# EAGLE design cirquit (EAGLE 8.3.2)
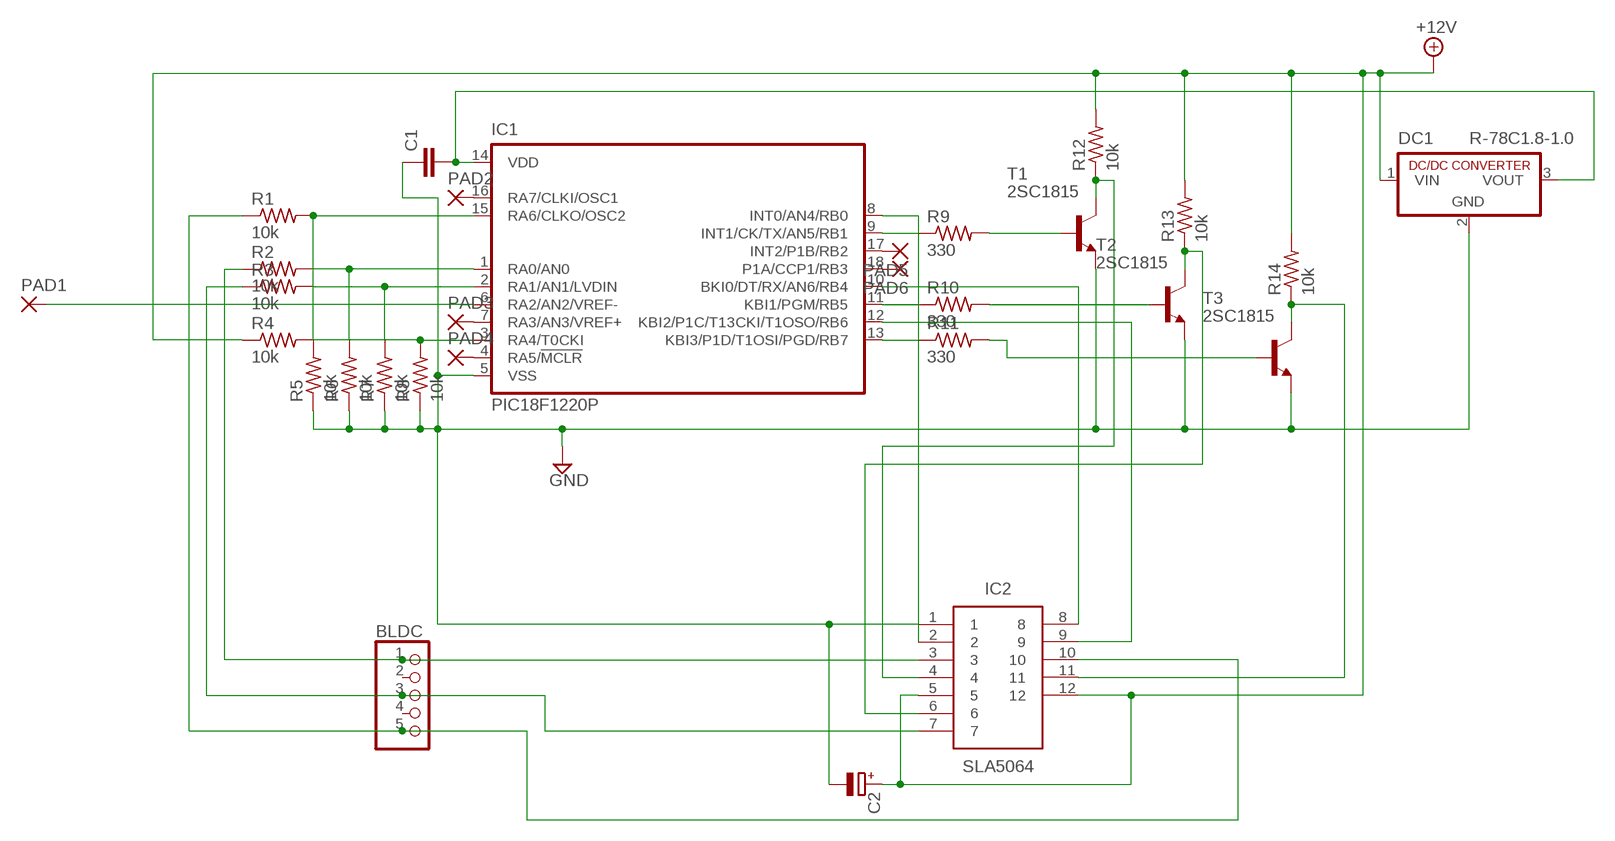
[diagram p0: schematic, sheet 1]

## Parts
BLDC  PINHD-1X5  [1X05]
C1  C2.5/2  [C2.5-2]
C2  CPOL-EUE2,5-6E  [E2,5-6E]
DC1  R-78C1.8-1.0  [SIP3]
IC1  PIC18F1220P  [DIL18]
IC2  SLA5064  [TO254P500X3150X1890-12P]
PAD1  1,6/0,8  [1,6/0,8]
PAD2  1,6/0,8  [1,6/0,8]
PAD3  1,6/0,8  [1,6/0,8]
PAD4  1,6/0,8  [1,6/0,8]
PAD5  1,6/0,8  [1,6/0,8]
PAD6  1,6/0,8  [1,6/0,8]
R1  10k  R-US_0204/7  [0204/7]
R2  10k  R-US_0204/7  [0204/7]
R3  10k  R-US_0204/7  [0204/7]
R4  10k  R-US_0204/7  [0204/7]
R5  10k  R-US_0204/7  [0204/7]
R6  10k  R-US_0204/7  [0204/7]
R7  10k  R-US_0204/7  [0204/7]
R8  10k  R-US_0204/7  [0204/7]
R9  330  R-US_0204/7  [0204/7]
R10  330  R-US_0204/7  [0204/7]
R11  330  R-US_0204/7  [0204/7]
R12  10k  R-US_0204/7  [0204/7]
R13  10k  R-US_0204/7  [0204/7]
R14  10k  R-US_0204/7  [0204/7]
T1  2SC1815  [TO92-ECB]
T2  2SC1815  [TO92-ECB]
T3  2SC1815  [TO92-ECB]

## Nets
+12V: C2.+ DC1.1(VIN) IC2.5 IC2.12 R4.1 R12.2 R13.2 R14.2
GND: C1.1 C2.- DC1.2(GND) IC1.5(VSS) IC2.1 R5.1 R6.1 R7.1 R8.1 T1.E T2.E T3.E
N$1: IC1.15(RA6/CLKO/OSC2) R1.2 R5.2
N$2: IC1.1(RA0/AN0) R2.2 R6.2
N$3: IC1.2(RA1/AN1/LVDIN) R3.2 R7.2
N$4: IC1.3(RA4/T0CKI) R4.2 R8.2
N$5: IC1.16(RA7/CLKI/OSC1) PAD2.1(P)
N$6: BLDC.1 IC2.3 R2.1
N$7: BLDC.3 IC2.7 R3.1
N$9: IC1.9(INT1/CK/TX/AN5/RB1) R9.1
N$10: IC1.11(KBI1/PGM/RB5) R10.1
N$11: IC1.13(KBI3/P1D/T1OSI/PGD/RB7) R11.1
N$12: R9.2 T1.B
N$13: R10.2 T2.B
N$14: R11.2 T3.B
N$15: IC2.4 R12.1 T1.C
N$16: IC2.6 R13.1 T2.C
N$17: IC2.11 R14.1 T3.C
N$18: IC1.7(RA3/AN3/VREF+) PAD3.1(P)
N$19: IC1.4(RA5/!MCLR) PAD4.1(P)
N$20: IC1.17(INT2/P1B/RB2) PAD5.1(P)
N$21: IC1.18(P1A/CCP1/RB3) PAD6.1(P)
N$22: IC1.8(INT0/AN4/RB0) IC2.2
N$23: IC1.10(BKI0/DT/RX/AN6/RB4) IC2.8
N$24: IC1.12(KBI2/P1C/T13CKI/T1OSO/RB6) IC2.9
N$25: IC1.6(RA2/AN2/VREF-) PAD1.1(P)
N$26: C1.2 DC1.3(VOUT) IC1.14(VDD)
N$28: BLDC.5 IC2.10 R1.1
Unconnected: BLDC.2 BLDC.4

## Library data of the parts
BLDC = pinhead:PINHD-1X5: PIN HEADER
C1 = capacitor-wima:C: CAPACITOR naming: grid - package width
C2 = resistor:CPOL-EU: POLARIZED CAPACITOR, European symbol
DC1 = dc-dc-converter:R-78C*-1.0: INNOLINE DC/DC-Converter 1.0 AMP SIP3 Single Output Source: Data sheet <http://www.mikrocontroller.net/attachment/150645/157764-da-01-en-DC_DC_WANDLER_R_78C5_0_1_0.pdf>
IC1 = microchip:PIC18F1*20: 18/20/28-Pin High-Performance, Enhanced Flash Microcontrollers with 10-bit A/D and nanoWatt Technology Source: ww1.microchip.com/downloads/en/DeviceDoc/39605c.pdf; MF: MICROCHIP; MPN: PIC18F1220-I/P; OC_FARNELL: 9761977; OC_NEWARK: 92C2429
IC2 = SLA5064:SLA5064: N-channel+P-channel 3-phase motor drive <https://componentsearchengine.com/Images/9/SLA5064.jpg> Source: Datasheet <http://akizukidenshi.com/download/ds/sanken/sla5064_ds_jp.pdf>; DESCRIPTION: N-channel+P-channel 3-phase motor drive; HEIGHT: 5mm; MANUFACTURER_NAME: Sanken; MANUFACTURER_PART_NUMBER: SLA5064; SUPPLIER_NAME: RS
PAD1-PAD6 = wirepad:1,6/0,8: THROUGH-HOLE PAD
R1-R14 = resistor:R-US_: RESISTOR, American symbol
T1-T3 = transistor:2SC1815: NPN EPITAXIAL TRANSISTOR Source: TOSHIBA .. 2SC1815 1.pdf

## Board
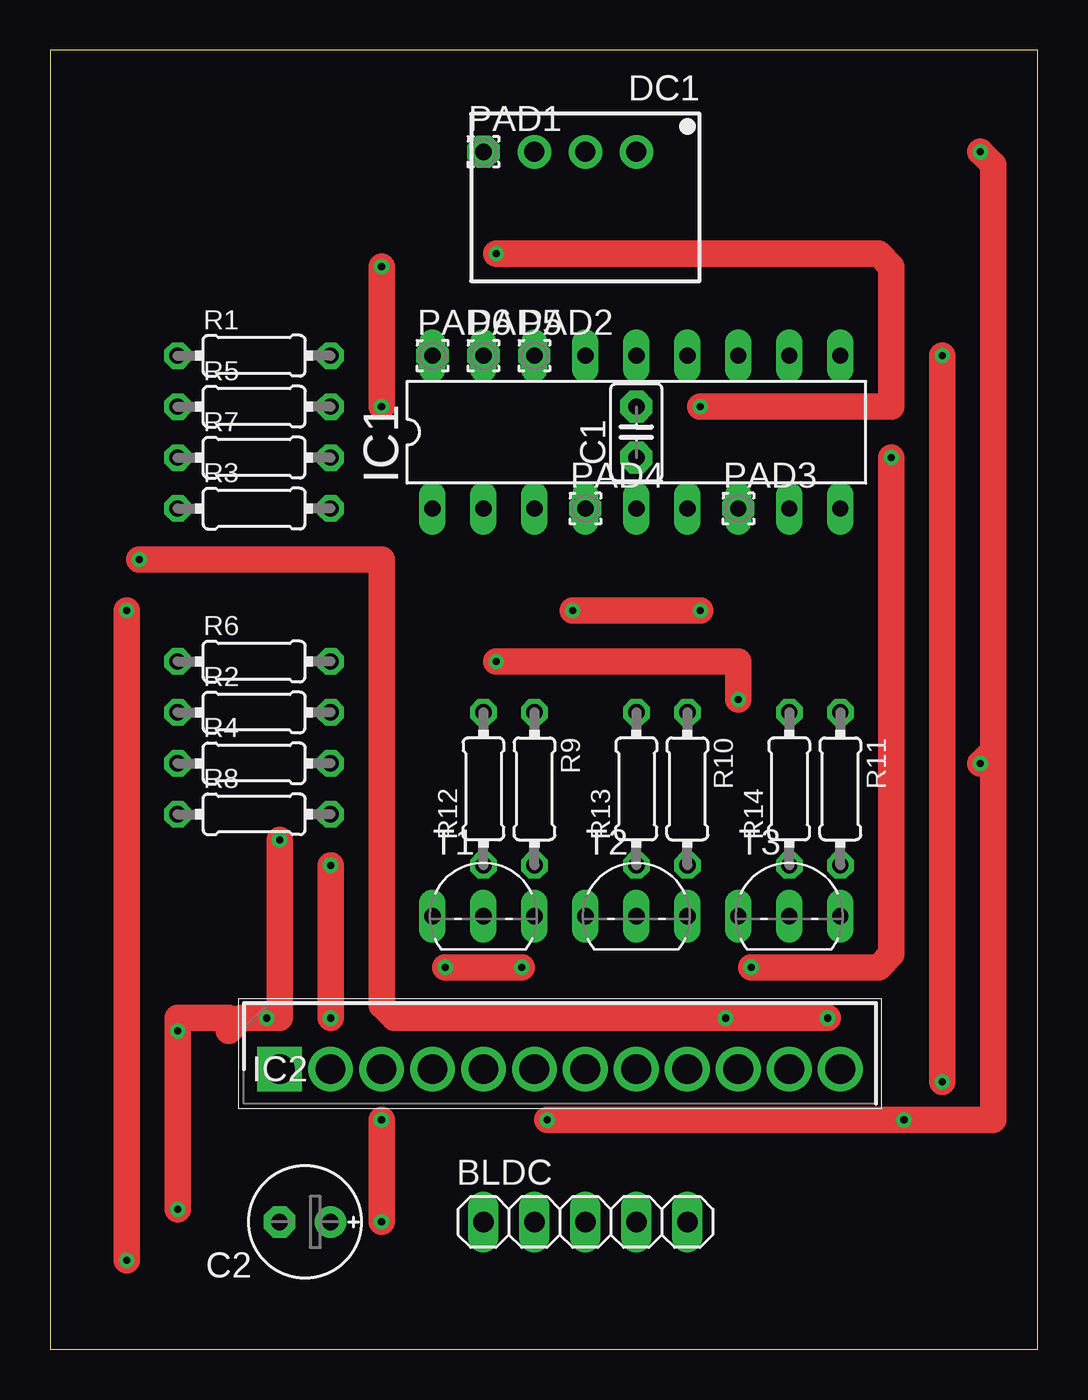
[diagram p1: board, top side]
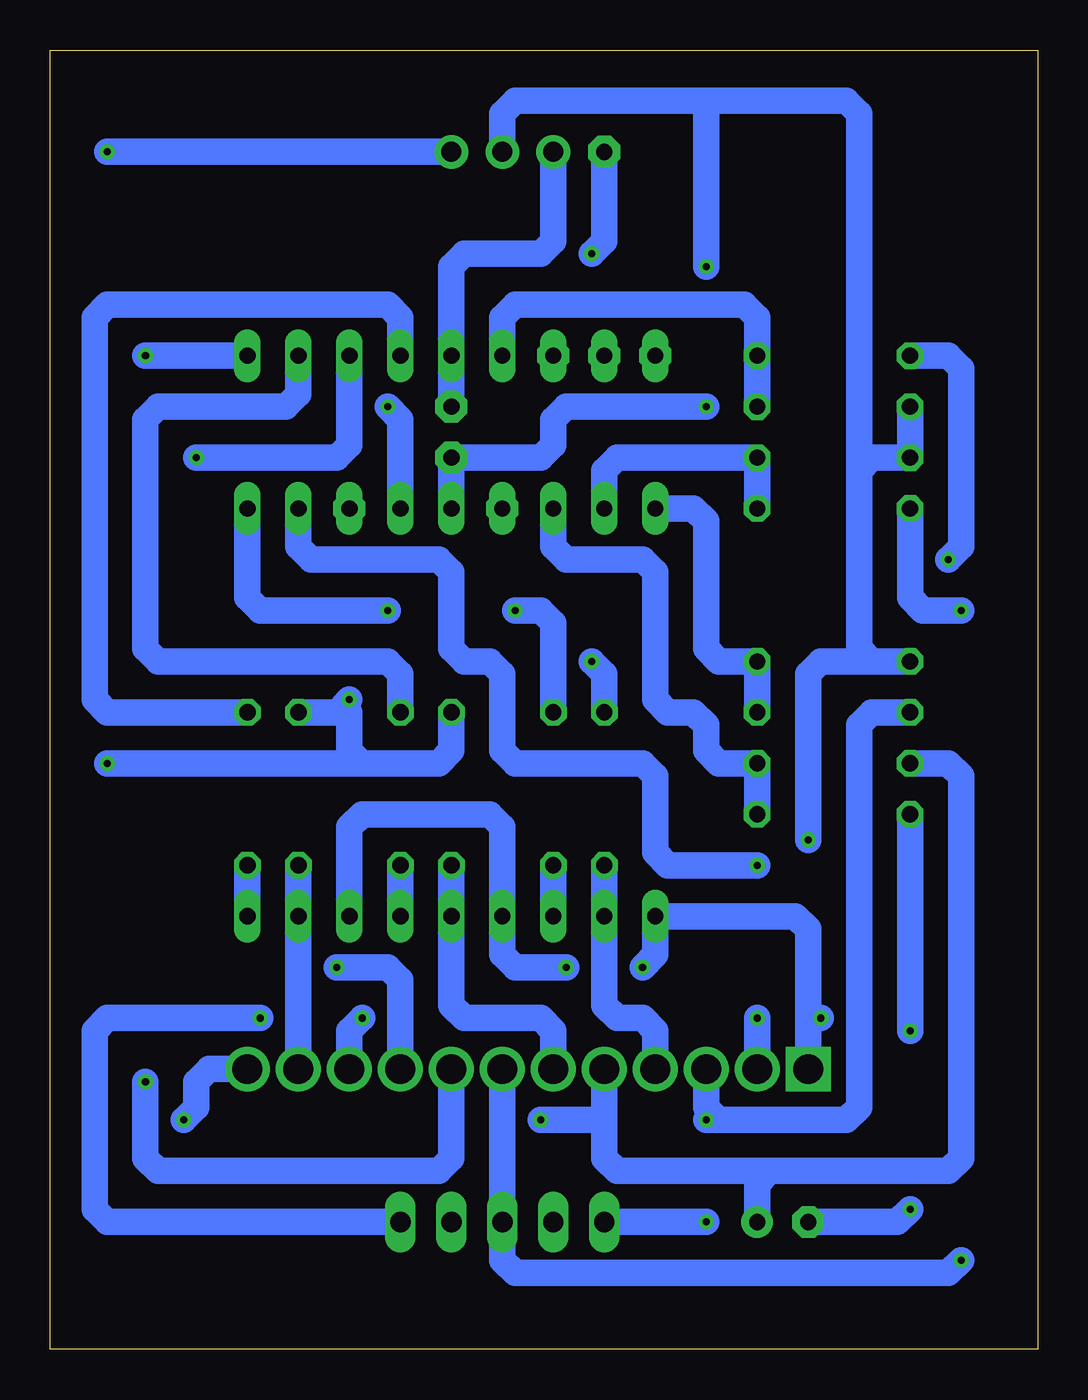
[diagram p2: board, bottom side, seen from below]

Size 49.2 x 64.76 mm. Coordinates in mm from the lower left corner, seen from the top.
Outline: 0,0 49.2,0 49.2,64.76 0,64.76 0,0
Copper layers (1*16): Top 0.035mm / dielectric 1.5mm / Bottom 0.035mm
Design rules "default *": minimum track width 51.5mil, minimum drill 0.35mm, track to track 6mil, track to pad 6mil, pad to pad 6mil, via to via 6mil, smd to smd 6mil, copper to edge 40mil, drill to drill 6mil, minimum pad ring 10mil, minimum via ring 8mil, stop-mask expansion 4mil, vias tented up to drill 0mil, thermal gap 10mil
tRestrict: area 13.7,44.1 to 14.3,44.8; area 8.6,49.2 to 9.2,49.8; area 6,28.9 to 6.7,29.5; area 11.1,26.4 to 11.7,27; area 11.1,34 to 11.7,34.6; area 17.5,30.2 to 18.1,30.8; area 17.5,27.6 to 18.1,28.3; area 17.5,25.1 to 18.1,25.7; area 20,30.2 to 20.6,30.8; area 22.5,30.2 to 23.2,30.8; area 20,27.6 to 20.6,28.3; area 22.5,27.6 to 23.2,28.3; 557 more areas
bRestrict: area 17.5,30.2 to 18.1,30.8; area 20,30.2 to 20.6,30.8; area 20,27.6 to 20.6,28.3; area 17.5,27.6 to 18.1,28.3; area 17.5,25.1 to 18.1,25.7; area 20,25.1 to 20.6,25.7; area 22.5,30.2 to 23.2,30.8; area 22.5,27.6 to 23.2,28.3; area 22.5,25.1 to 23.2,25.7; area 25.1,30.2 to 25.7,30.8; area 27.6,30.2 to 28.3,30.8; area 27.6,27.6 to 28.3,28.3; 438 more areas

### Footprints (pad centres in the part's own frame; a part is rotated, then mirrored left to right if it is on the bottom)
1X05 = drill 1.016 long: 1 -5.08,0; 2 -2.54,0; 3 0,0; 4 2.54,0; 5 5.08,0
C2.5-2 = drill 0.813 pad 1.6 octagon: 1 -1.27,0; 2 1.27,0
E2,5-6E = drill 0.813 pad 1.575: + -1.27,0 | drill 0.813 pad 1.575 octagon: - 1.27,0
SIP3 = drill 1 pad 1.676: 1 -2.54,0; 2 0,0; 3 2.54,0
DIL18 = drill 0.813 long: 1 -10.16,-3.81; 2 -7.62,-3.81; 3 -5.08,-3.81; 4 -2.54,-3.81; 5 0,-3.81; 6 2.54,-3.81; 7 5.08,-3.81; 8 7.62,-3.81; 9 10.16,-3.81; 10 10.16,3.81; 11 7.62,3.81; 12 5.08,3.81; 13 2.54,3.81; 14 0,3.81; 15 -2.54,3.81; 16 -5.08,3.81; 17 -7.62,3.81; 18 -10.16,3.81
TO254P500X3150X1890-12P = drill 1.49 pad 2.235 square: 1 0,0 | drill 1.49 pad 2.235: 2 2.54,0; 3 5.08,0; 4 7.62,0; 5 10.16,0; 6 12.7,0; 7 15.24,0; 8 17.78,0; 9 20.32,0; 10 22.86,0; 11 25.4,0; 12 27.94,0
1,6/0,8 = drill 0.813 pad 1.6 octagon: 1 0,0
0204/7 = drill 0.813 octagon: 1 -3.81,0; 2 3.81,0
TO92-ECB = drill 0.813 long: B 2.54,0; C 0,0; E -2.54,0

### Placement (x,y rotation side)
BLDC  26.67,6.35 0 top
C1  29.21,45.72 90 top
C2  12.7,6.35 180 top
DC1  26.67,59.69 180 top
IC1  29.21,45.72 0 top
IC2  11.43,13.97 0 top
PAD1  21.59,59.69 0 top
PAD2  24.13,49.53 0 top
PAD3  34.29,41.91 0 top
PAD4  26.67,41.91 0 top
PAD5  21.59,49.53 0 top
PAD6  19.05,49.53 0 top
R1  10.16,49.53 0 top
R2  10.16,31.75 0 top
R3  10.16,41.91 0 top
R4  10.16,29.21 0 top
R5  10.16,46.99 0 top
R6  10.16,34.29 0 top
R7  10.16,44.45 0 top
R8  10.16,26.67 0 top
R9  24.13,27.94 270 top
R10  31.75,27.94 270 top
R11  39.37,27.94 270 top
R12  21.59,27.94 90 top
R13  29.21,27.94 90 top
R14  36.83,27.94 90 top
T1  21.59,21.59 0 top
T2  29.21,21.59 0 top
T3  36.83,21.59 0 top

### Tracks (layer width: path | path; a pad name or v marks a point on that pad's centre or on a via)
+12V  (via drill 0.35)
  Top 1.308: v22.23,34.29 34.29,34.29 v34.29,32.38 | v46.35,59.69 46.99,59.05 46.99,29.84 | v46.35,29.21 46.99,29.84 | 46.99,29.84 46.99,11.43 v42.54,11.43 v24.77,11.43
  Bottom 1.308: R4.1 4.45,29.21 3.81,28.57 3.81,9.53 4.45,8.89 13.34,8.89 | 13.34,8.89 13.97,8.26 C2.+ | 21.59,11.43 21.59,9.53 20.96,8.89 13.34,8.89 | 21.59,11.43 IC2.5 | R12.2 21.59,33.65 v22.23,34.29 | 34.61,32.07 34.92,31.75 R14.2 | 34.61,32.07 v34.29,32.38 | R13.2 29.21,29.84 29.84,29.21 33.65,29.21 | 33.65,29.21 34.29,29.84 34.29,31.75 34.61,32.07 | v46.35,59.69 DC1.1 | 33.65,29.21 v46.35,29.21 | IC2.12 41.27,13.97 41.91,13.34 41.91,12.07 v42.54,11.43 | v24.77,11.43 21.59,11.43
GND  (via drill 0.35)
  Top 1.308: v6.35,6.99 v6.35,15.88 6.35,16.51 8.89,16.51 8.89,15.88 9.53,16.51 v10.79,16.51 11.43,16.51 v11.43,25.4 | v19.68,19.05 v23.5,19.05 | v16.51,53.97 v16.51,46.99
  Bottom 1.308: v6.35,15.88 R8.1 | v6.35,6.99 6.99,6.35 C2.- | T3.E 34.29,26.04 33.65,26.67 27.3,26.67 26.67,26.04 T2.E 26.67,19.68 26.04,19.05 v23.5,19.05 | IC2.1 11.43,16.51 | 11.43,16.51 11.43,20.96 12.07,21.59 T1.E 19.05,19.68 v19.68,19.05 | v10.79,16.51 11.43,16.51 | IC1.5 C1.1 24.77,44.45 24.13,45.08 24.13,46.35 23.5,46.99 v16.51,46.99 | 8.26,34.29 R6.1 | 8.26,34.29 8.89,34.92 8.89,43.81 | 8.89,43.81 8.26,44.45 R7.1 R5.1 | DC1.2 26.67,61.59 26.04,62.23 16.51,62.23 | 16.51,62.23 9.53,62.23 8.89,61.59 8.89,43.81 | v16.51,53.97 16.51,62.23 | v11.43,25.4 11.43,33.65 10.79,34.29 8.26,34.29
N$1
  Bottom 1.308: R5.2 R1.2 13.97,51.43 14.61,52.07 26.04,52.07 26.67,51.43 IC1.15
N$2
  Bottom 1.308: R2.2 R6.2 15.88,34.29 16.51,34.92 16.51,41.27 17.14,41.91 IC1.1
N$3
  Bottom 1.308: R3.2 R7.2 20.96,44.45 21.59,43.81 IC1.2
N$4
  Bottom 1.308: R8.2 R4.2 15.88,29.21 16.51,29.84 16.51,31.11 17.14,31.75 18.41,31.75 19.05,32.38 19.05,38.73 19.68,39.37 23.5,39.37 24.13,40 IC1.3
N$6  (via drill 0.35)
  Top 1.308: v16.51,11.43 v16.51,6.35
  Bottom 1.308: R2.1 8.26,31.75 8.89,31.11 8.89,12.07 9.53,11.43 15.88,11.43 | 15.88,11.43 16.51,12.07 IC2.3 | v16.51,6.35 BLDC.1 | v16.51,11.43 15.88,11.43
N$7  (via drill 0.35)
  Top 1.308: v3.81,4.45 v3.81,36.83
  Bottom 1.308: R3.1 6.35,37.46 5.71,36.83 v3.81,36.83 | v3.81,4.45 4.45,3.81 26.04,3.81 26.67,4.45 BLDC.3 IC2.7
N$9  (via drill 0.35)
  Top 1.308: v32.38,36.83 v26.04,36.83
  Bottom 1.308: R9.1 24.13,36.2 24.77,36.83 v26.04,36.83 | v32.38,36.83 38.73,36.83 39.37,37.46 IC1.9
N$10
  Bottom 1.308: R10.1 31.75,33.65 32.38,34.29 43.81,34.29 44.45,34.92 44.45,46.35 43.81,46.99 37.46,46.99 36.83,47.62 IC1.11
N$11
  Bottom 1.308: R11.1 46.35,31.75 46.99,32.38 46.99,51.43 46.35,52.07 32.38,52.07 31.75,51.43 IC1.13
N$12
  Bottom 1.308: R9.2 T1.B
N$13
  Bottom 1.308: R10.2 T2.B
N$14
  Bottom 1.308: R11.2 T3.B
N$15
  Bottom 1.308: R12.1 T1.C 21.59,17.14 20.96,16.51 19.68,16.51 19.05,15.88 IC2.4
N$16
  Bottom 1.308: R13.1 T2.C 29.21,17.14 28.57,16.51 24.77,16.51 24.13,15.88 IC2.6
N$17
  Bottom 1.308: R14.1 T3.C IC2.11
N$22  (via drill 0.35)
  Top 1.308: v13.97,16.51 v13.97,24.13
  Bottom 1.308: IC1.8 36.83,40 36.2,39.37 29.84,39.37 29.21,38.73 29.21,34.92 28.57,34.29 27.3,34.29 26.67,33.65 26.67,29.84 26.04,29.21 19.68,29.21 19.05,28.57 19.05,24.77 18.41,24.13 v13.97,24.13 | IC2.2 v13.97,16.51
N$23  (via drill 0.35)
  Top 1.308: v44.45,13.34 v44.45,49.53
  Bottom 1.308: v44.45,49.53 IC1.10 | v44.45,13.34 44.45,9.53 43.81,8.89 29.84,8.89 29.21,9.53 IC2.8
N$24  (via drill 0.35)
  Top 1.308: v41.91,44.45 41.91,19.68 41.27,19.05 v34.92,19.05
  Bottom 1.308: IC1.12 34.29,45.08 34.92,44.45 v41.91,44.45 | v34.92,19.05 32.38,19.05 31.75,18.41 IC2.9
N$25  (via drill 0.35)
  Top 1.308: v32.38,46.99 41.91,46.99 41.91,53.97 41.27,54.61 v22.23,54.61
  Bottom 1.308: IC1.6 31.75,46.35 v32.38,46.99 | v22.23,54.61 21.59,55.24 PAD1.1
N$26
  Bottom 1.308: C1.2 IC1.14 29.21,53.97 28.57,54.61 24.77,54.61 24.13,55.24 DC1.3
N$28  (via drill 0.35)
  Top 1.308: v4.45,39.37 16.51,39.37 16.51,17.14 17.14,16.51 v33.65,16.51 v38.73,16.51
  Bottom 1.308: R1.1 4.45,49.53 3.81,48.89 3.81,40 v4.45,39.37 | v33.65,16.51 34.29,15.88 IC2.10 | BLDC.5 46.35,6.35 46.99,6.99 46.99,15.88 46.35,16.51 v38.73,16.51